# Altium project PCB_Project.PrjPcb
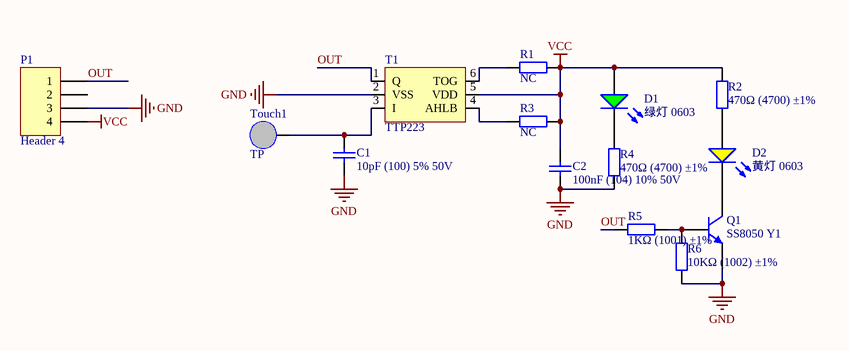
[diagram p0: key.SchDoc]
1 sheet, 14 parts. Net scope: global (net labels, ports and power ports of the same name join across sheets).
Board files: key.PcbDoc, key_com.PcbDoc

## Sheet key.SchDoc
size A4

### Parts
C1  10pF (100) 5% 50V  [0603_C]
C2  100nF (104) 10% 50V  [0603_C]
D1  绿灯 0603  [0603_LED_S1]
D2  黄灯 0603  [0603_LED_S1]
P1  Header 4  [FPC1.0-2H-WS-4P]
Q1  SS8050 Y1  [SOT-23(SOT-23-3)]
R1  NC  [0603_R]
R2  470Ω (4700) ±1%  [0603_R]
R3  NC  [0603_R]
R4  470Ω (4700) ±1%  [0603_R]
R5  1KΩ (1001) ±1%  [0603_R]
R6  10KΩ (1002) ±1%  [0603_R]
T1  TTP223  [SOT-23-6]
Touch1  TP  [TP]

### Nets
GND: C1.1 C2.1 P1.3 Q1.2(E) R4.1 R6.1 T1.2(VSS)
VCC: C2.2 D1.A P1.4 R1.2 R2.2 R3.2 T1.5(VDD)
OUT: P1.1 R5.1 T1.1(Q)
NetC1_2: C1.2 T1.3(I) Touch1.1
NetD1_K: D1.K R4.2
NetD2_A: D2.A R2.1
NetD2_K: D2.K Q1.3(C)
NetQ1_1: Q1.1(B) R5.2 R6.2
NetR1_1: R1.1 T1.6(TOG)
NetR3_1: R3.1 T1.4(AHLB)

Not connected (* = marked no-connect by the designer): P1 2

### Library data of the parts
C1 = 0603 10pF (100) 5% 50V: 贴片电容; ComponentLink1Description: 供应商链接; ComponentLink1URL: http://www.szlcsc.com/product/details_1986.html; Package: 0603; Supplier: LC; SuppliersPartNumber: C1634
C2 = 0603 100nF (104) 10% 50V: 贴片电容; ComponentLink1Description: 供应商链接; ComponentLink1URL: http://www.szlcsc.com/product/details_15331.html; Package: 0603; Supplier: LC; SuppliersPartNumber: C14663
D1 = 0603 绿灯: 发光二极管; ComponentLink1Description: 供应商链接; ComponentLink1URL: http://www.szlcsc.com/product/details_73152.html; Package: 0603; Supplier: LC; SuppliersPartNumber: C72043
D2 = 0603 黄灯: 发光二极管; ComponentLink1Description: 供应商链接; ComponentLink1URL: http://www.szlcsc.com/product/details_73147.html; Package: 0603; Supplier: LC; SuppliersPartNumber: C72038
P1 = Header 4: Header, 4-Pin; LatestRevisionDate: 17-Jul-2002; LatestRevisionNote: Re-released for DXP Platform.; Publisher: Altium Limited
Q1 = SOT-23 SS8050 Y1: 三极管; ComponentLink1Description: 供应商链接; ComponentLink1URL: http://www.szlcsc.com/product/details_2507.html; Package: SOT-23; Supplier: LC; SuppliersPartNumber: C2150
R1 R3 R6 = 0603 10KΩ (1002) 1%: 贴片电阻; ComponentLink1Description: 供应商链接; ComponentLink1URL: http://www.szlcsc.com/product/details_26547.html; Package: 0603; Supplier: LC; SuppliersPartNumber: C25804
R2 R4 = 0603 470Ω (4700) 1%: 贴片电阻; ComponentLink1Description: 供应商链接; ComponentLink1URL: http://www.szlcsc.com/product/details_23906.html; Package: 0603; Supplier: LC; SuppliersPartNumber: C23179
R5 = 0603 1KΩ (1001) 1%: 贴片电阻; ComponentLink1Description: 供应商链接; ComponentLink1URL: http://www.szlcsc.com/product/details_21904.html; Package: 0603; Supplier: LC; SuppliersPartNumber: C21190